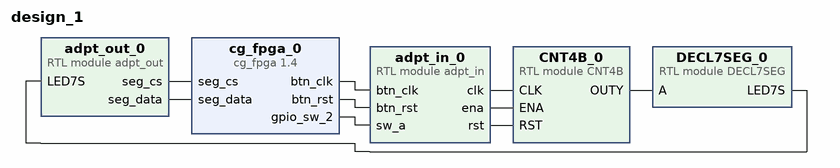
[diagram p0: block diagram of the top level]
# Vivado block design design_1, xc7z020clg400-1, Vivado 2024.2
create_bd_design design_1

create_bd_cell -type ip -vlnv educg.net:user:cg_fpga:1.4 cg_fpga_0
create_bd_cell -type module -reference adpt_in adpt_in_0
create_bd_cell -type module -reference DECL7SEG DECL7SEG_0
create_bd_cell -type module -reference CNT4B CNT4B_0
create_bd_cell -type module -reference adpt_out adpt_out_0

# ---- connections ----

connect_bd_net [get_bd_pins CNT4B_0/OUTY] [get_bd_pins DECL7SEG_0/A]
connect_bd_net [get_bd_pins DECL7SEG_0/LED7S] [get_bd_pins adpt_out_0/LED7S]
connect_bd_net [get_bd_pins adpt_in_0/clk] [get_bd_pins CNT4B_0/CLK]
connect_bd_net [get_bd_pins adpt_in_0/ena] [get_bd_pins CNT4B_0/ENA]
connect_bd_net [get_bd_pins adpt_in_0/rst] [get_bd_pins CNT4B_0/RST]
connect_bd_net [get_bd_pins adpt_out_0/seg_cs] [get_bd_pins cg_fpga_0/seg_cs]
connect_bd_net [get_bd_pins adpt_out_0/seg_data] [get_bd_pins cg_fpga_0/seg_data]
connect_bd_net [get_bd_pins cg_fpga_0/btn_clk] [get_bd_pins adpt_in_0/btn_clk]
connect_bd_net [get_bd_pins cg_fpga_0/btn_rst] [get_bd_pins adpt_in_0/btn_rst]
connect_bd_net [get_bd_pins cg_fpga_0/gpio_sw_2] [get_bd_pins adpt_in_0/sw_a]

validate_bd_design
save_bd_design
